# Altium schematic sheet Hydrophones.SchDoc
size 279 x 203 mm; SheetNumber: 7
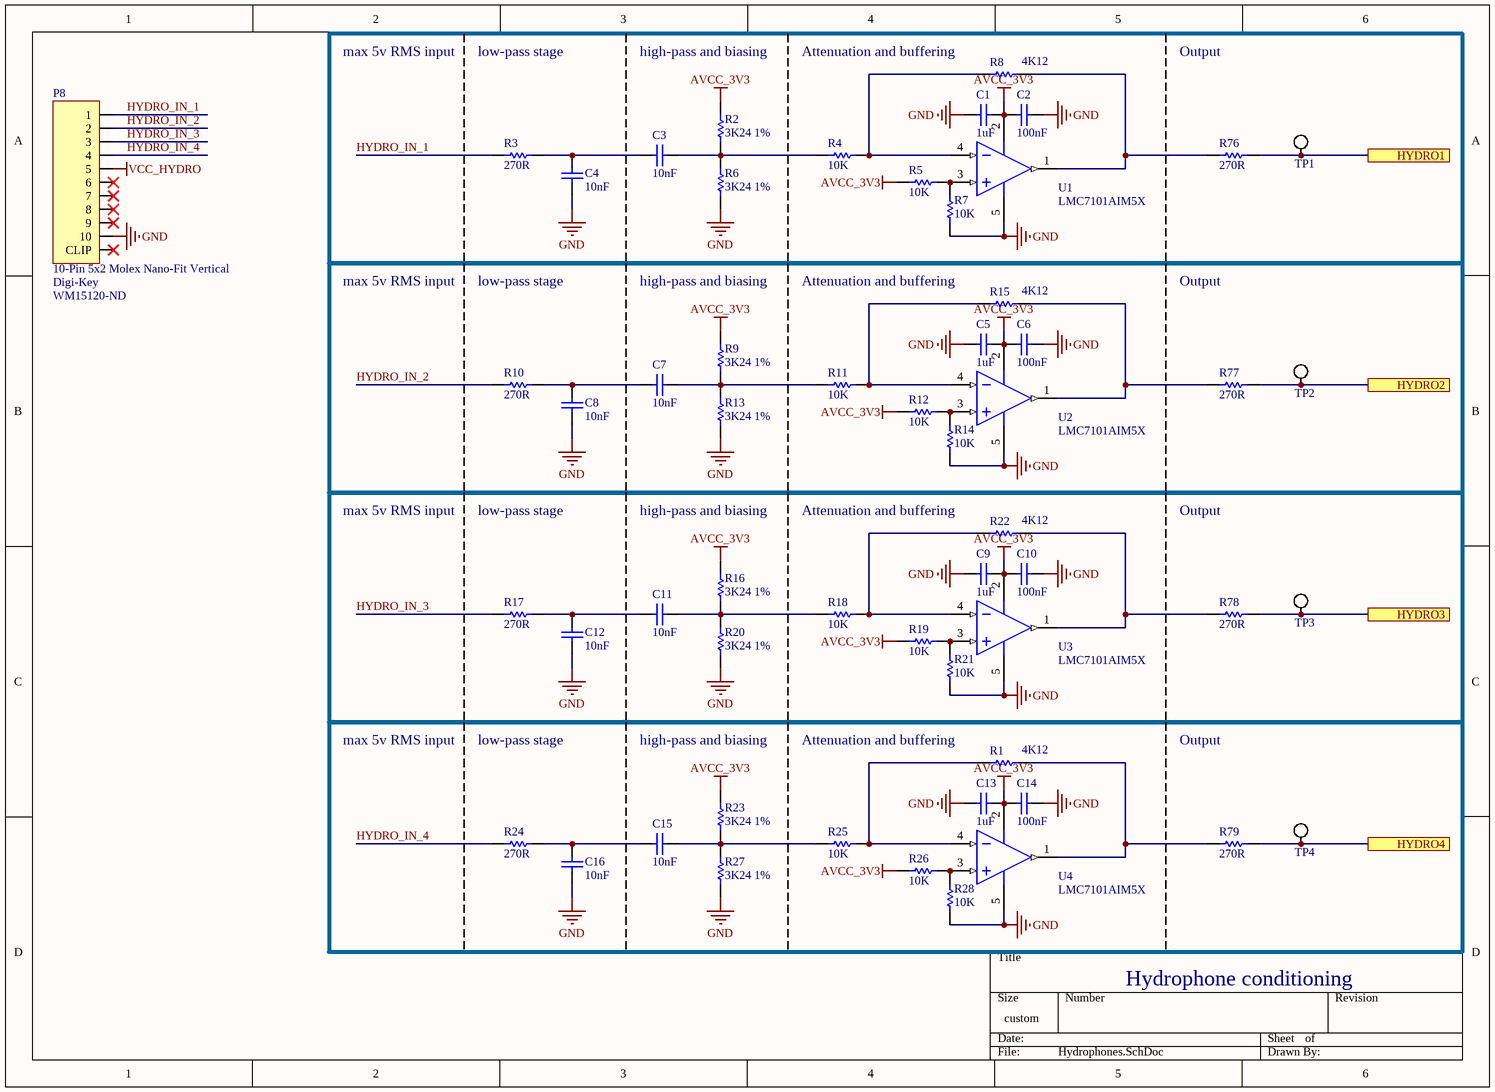
[diagram p0: Hydrophones.SchDoc]

## Parts
C1  1uF  [CAPC0603(1608)100_N]
C2  100nF  [CAPC0603(1608)100_N]
C3  10nF  [CAPC0603(1608)100_N]
C4  10nF  [CAPC0603(1608)100_N]
C5  1uF  [CAPC0603(1608)100_N]
C6  100nF  [CAPC0603(1608)100_N]
C7  10nF  [CAPC0603(1608)100_N]
C8  10nF  [CAPC0603(1608)100_N]
C9  1uF  [CAPC0603(1608)100_N]
C10  100nF  [CAPC0603(1608)100_N]
C11  10nF  [CAPC0603(1608)100_N]
C12  10nF  [CAPC0603(1608)100_N]
C13  1uF  [CAPC0603(1608)100_N]
C14  100nF  [CAPC0603(1608)100_N]
C15  10nF  [CAPC0603(1608)100_N]
C16  10nF  [CAPC0603(1608)100_N]
P8  10-Pin 5x2 Molex Nano-Fit Vertical  Supplier 1: Digi-Key  Supplier Part Number 1: WM15120-ND  [MOLEX NANO-FIT 2x5 - Vertical]
R1  4K12  [RESC0603(1608)_M]
R2  3K24 1%  [RESC0603(1608)_N]
R3  270R  [RESC0603(1608)_N]
R4  10K  [RESC0603(1608)_N]
R5  10K  [RESC0603(1608)_N]
R6  3K24 1%  [RESC0603(1608)_N]
R7  10K  [RESC0603(1608)_N]
R8  4K12  [RESC0603(1608)_M]
R9  3K24 1%  [RESC0603(1608)_N]
R10  270R  [RESC0603(1608)_N]
R11  10K  [RESC0603(1608)_N]
R12  10K  [RESC0603(1608)_N]
R13  3K24 1%  [RESC0603(1608)_N]
R14  10K  [RESC0603(1608)_N]
R15  4K12  [RESC0603(1608)_M]
R16  3K24 1%  [RESC0603(1608)_N]
R17  270R  [RESC0603(1608)_N]
R18  10K  [RESC0603(1608)_N]
R19  10K  [RESC0603(1608)_N]
R20  3K24 1%  [RESC0603(1608)_N]
R21  10K  [RESC0603(1608)_N]
R22  4K12  [RESC0603(1608)_M]
R23  3K24 1%  [RESC0603(1608)_N]
R24  270R  [RESC0603(1608)_N]
R25  10K  [RESC0603(1608)_N]
R26  10K  [RESC0603(1608)_N]
R27  3K24 1%  [RESC0603(1608)_N]
R28  10K  [RESC0603(1608)_N]
R76  270R  [RESC0603(1608)_N]
R77  270R  [RESC0603(1608)_N]
R78  270R  [RESC0603(1608)_N]
R79  270R  [RESC0603(1608)_N]
TP1  Test Point Loop  [Test Point Loop - Black]  (value not drawn)
TP2  Test Point Loop  [Test Point Loop - Black]  (value not drawn)
TP3  Test Point Loop  [Test Point Loop - Black]  (value not drawn)
TP4  Test Point Loop  [Test Point Loop - Black]  (value not drawn)
U1  LMC7101AIM5X  [DBV0005A_N]
U2  LMC7101AIM5X  [DBV0005A_N]
U3  LMC7101AIM5X  [DBV0005A_N]
U4  LMC7101AIM5X  [DBV0005A_N]

## Ports
HYDRO1, HYDRO2, HYDRO3, HYDRO4

## Nets
AVCC_3V3: C1.1 C2.2 C5.1 C6.2 C9.1 C10.2 C13.1 C14.2 R2.2 R5.1 R9.2 R12.1 R16.2 R19.1 R23.2 R26.1 U1.2(V+) U2.2(V+) U3.2(V+) U4.2(V+)
GND: C1.2 C2.1 C4.1 C5.2 C6.1 C8.1 C9.2 C10.1 C12.1 C13.2 C14.1 C16.1 P8.10 R6.1 R7.1 R13.1 R14.1 R20.1 R21.1 R27.1 R28.1 U1.5(V-) U2.5(V-) U3.5(V-) U4.5(V-)
VCC_HYDRO: P8.5
HYDRO1: R76.2 TP1.1 ; port HYDRO1
HYDRO2: R77.2 TP2.1 ; port HYDRO2
HYDRO3: R78.2 TP3.1 ; port HYDRO3
HYDRO4: R79.2 TP4.1 ; port HYDRO4
HYDRO_IN_1: P8.1 R3.1
HYDRO_IN_2: P8.2 R10.1
HYDRO_IN_3: P8.3 R17.1
HYDRO_IN_4: P8.4 R24.1
NetC3_1: C3.1 C4.2 R3.2
NetC3_2: C3.2 R2.1 R4.1 R6.2
NetC7_1: C7.1 C8.2 R10.2
NetC7_2: C7.2 R9.1 R11.1 R13.2
NetC11_1: C11.1 C12.2 R17.2
NetC11_2: C11.2 R16.1 R18.1 R20.2
NetC15_1: C15.1 C16.2 R24.2
NetC15_2: C15.2 R23.1 R25.1 R27.2
NetR1_1: R1.1 R25.2 U4.4(IN-)
NetR1_2: R1.2 R79.1 U4.1(OUT)
NetR4_2: R4.2 R8.1 U1.4(IN-)
NetR5_2: R5.2 R7.2 U1.3(IN+)
NetR8_2: R8.2 R76.1 U1.1(OUT)
NetR11_2: R11.2 R15.1 U2.4(IN-)
NetR12_2: R12.2 R14.2 U2.3(IN+)
NetR15_2: R15.2 R77.1 U2.1(OUT)
NetR18_2: R18.2 R22.1 U3.4(IN-)
NetR19_2: R19.2 R21.2 U3.3(IN+)
NetR22_2: R22.2 R78.1 U3.1(OUT)
NetR26_2: R26.2 R28.2 U4.3(IN+)

Not connected (* = marked no-connect by the designer): P8 6* 7* 8* 9* 11(CLIP)*

## Notes on the sheet
- max 5v RMS input
- low-pass stage
- high-pass and biasing
- (near R8) Attenuation and buffering
- Output
- (near R15) Attenuation and buffering
- (near R22) Attenuation and buffering
- (near R1) Attenuation and buffering
- Hydrophone conditioning

## Library data of the parts
C1 C5 C9 C13 = CMP-1035-02733-1: CAP 1uF 10V ±10% 0603 (1608 Metric) Thickness 1mm SMD; Tolerance: Â±10%; Case-EIA: 0603; Case-Metric: 1608; Rated Voltage: 10 V; Max Thickness: 1 mm; Value: 1uF; Technology: SMT
C2 C6 C10 C14 = CMP-1035-02580-1: CAP 100nF 10V ±10% 0603 (1608 Metric) Thickness 1mm SMD; Tolerance: Â±10%; Case-EIA: 0603; Case-Metric: 1608; Max Thickness: 1 mm; Value: 100nF; Rated Voltage: 10 V; Technology: SMT
C3 C4 C7 C8 C11 C12 C15 C16 = CMP-1035-02314-1: CAP 10nF 25V ±1% 0603 (1608 Metric) Thickness 1mm SMD; Case-EIA: 0603; Tolerance: Â±1%; Case-Metric: 1608; Technology: SMT; Value: 10nF; Rated Voltage: 25 V; Max Thickness: 1 mm
P8 = 10-Pin 2-Row Nano-Fit_Vertical: NanoFit VT Hdr TH DR 10Ckt; Part Number: 105314-1216; Supplier: Digi-Key; Manufacturer: Molex; Supplier Part Number: WM15165-ND; ComponentLink1Description: Digikey Link; ComponentLink1URL: https://www.digikey.com/product-detail/en/molex-llc/1053121310/WM15120-ND/6164209
R1 R8 R15 R22 = CMP-1012-00579-1: 4K12 0.1W 1% 0603 (1608 Metric)  SMD; Case-EIA: 0603; Value: 4120.00 Ohm; Case-Metric: 1608; Technology: SMT; Tolerance: 1 %; Power: 0.1 W
R2 R6 R9 R13 R16 R20 R23 R27 = CMP-1012-00566-1: 3K24 0.1W 1% 0603 (1608 Metric)  SMD; Value: 3240.00 Ohm; Case-Metric: 1608; Case-EIA: 0603; Tolerance: 1 %; Technology: SMT; Power: 0.1 W
R3 R10 R17 R24 R76-R79 = CMP-1012-00444-1: 270R 0.1W 1% 0603 (1608 Metric)  SMD; Value: 270.00 Ohm; Case-EIA: 0603; Case-Metric: 1608; Technology: SMT; Power: 0.1 W; Tolerance: 1 %
R4 R5 R7 R11 R12 R14 R18 R19 R21 R25 R26 R28 = CMP-1012-00623-1: 10K 0.1W 1% 0603 (1608 Metric)  SMD; Value: 10000.00 Ohm; Case-EIA: 0603; Case-Metric: 1608; Power: 0.1 W; Tolerance: 1 %; Technology: SMT
TP1-TP4 = Test Point Loop: Keyston Electronics 5001 Test Point Loop; Manufacturer P/N: 5001; Manufacturer: Keystone Electronics; Color: Black; Supplier 1: Digi-Key; Supplier Part Number 1: 36-5001-ND
U1-U4 = CMP-0055-01331-3: Tiny Low Power Operational Amplifier with Rail-to-Rail Input and Output, 5-pin SOT-23; Manufacturer: Texas Instruments; CompType: Amplifiers; PowerWise: N; PackageTopMarking: A00A*XTT; Package Reference: DBV0005A; ComponentLink1URL: http://www.ti.com/general/docs/lit/getliterature.tsp?genericPartNumber=LMC7101&fileType=pdf; ComponentLink1Description: Datasheet URL; RoHS: N; PackageDescription: Molded SOT-23, .115 x .063 x .040 in Body, 5 Lead, .0375 in Pitch; PinCount: 5